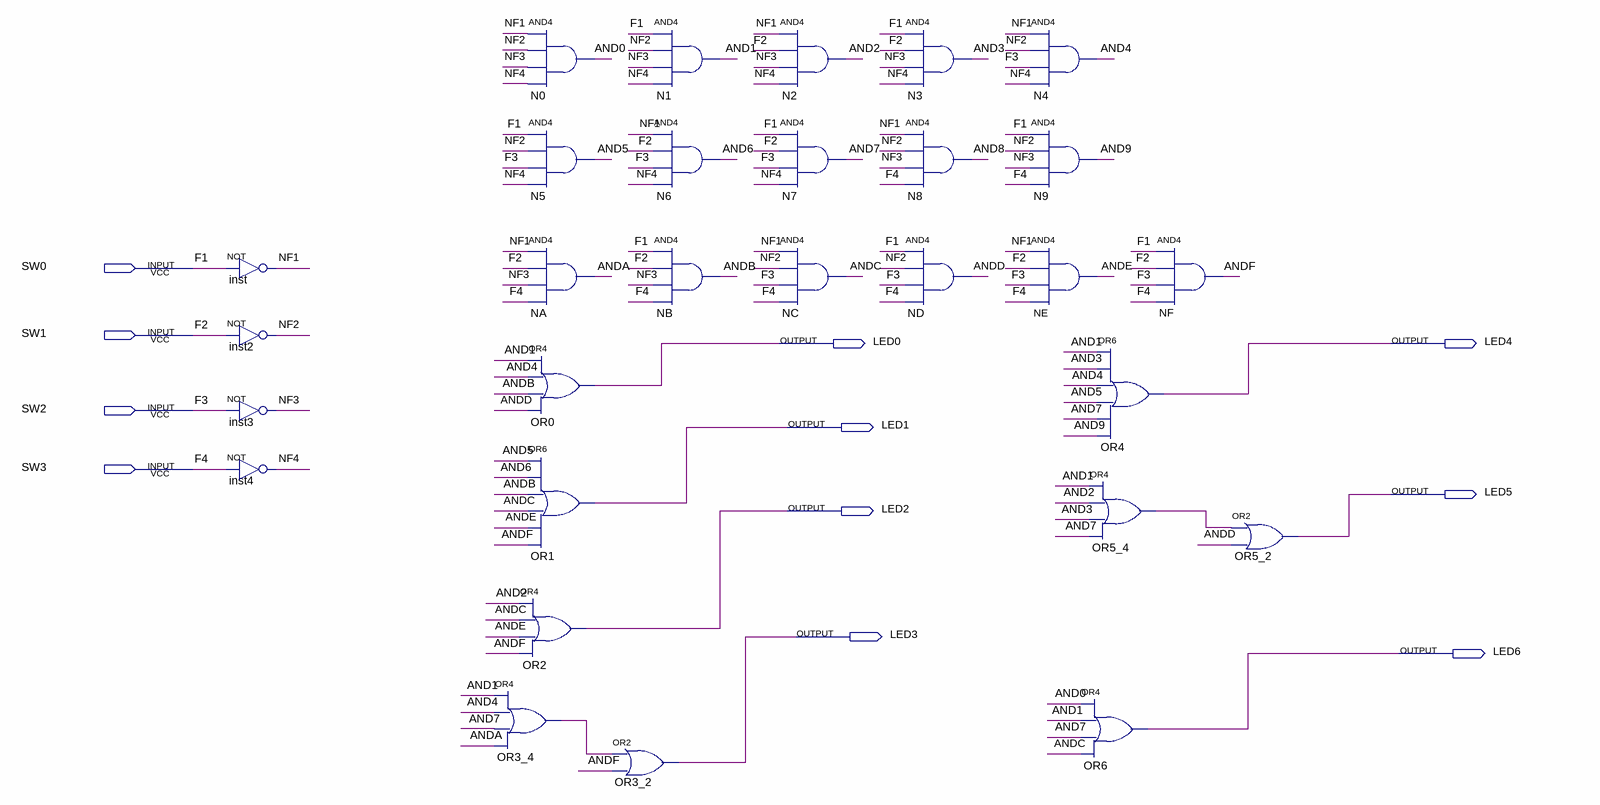
[diagram p0: schematic sheet]
// Quartus schematic Aula04.bdf as structural Verilog: 29 symbols, 11 pins
module Aula04 (
  input  SW0,
  input  SW1,
  input  SW2,
  input  SW3,
  output LED0,
  output LED4,
  output LED1,
  output LED5,
  output LED2,
  output LED3,
  output LED6
);

  wire AND0, AND1, AND2, AND3, AND4, AND5, AND6, AND7, AND8, AND9, ANDA, ANDB, ANDC, ANDD, ANDE, ANDF, NF1,
       NF2, NF3, NF4, OR3_4_out, OR5_4_out;

  not inst (NF1, SW0);
  not inst2 (NF2, SW1);
  not inst3 (NF3, SW2);
  not inst4 (NF4, SW3);
  or OR3_4 (OR3_4_out, AND1, AND4, AND7, ANDA);
  and N0 (AND0, NF1, NF2, NF3, NF4);
  and N5 (AND5, SW0, NF2, SW2, NF4);
  and NA (ANDA, NF1, SW1, NF3, SW3);
  or OR0 (LED0, AND1, AND4, ANDB, ANDD);
  or OR1 (LED1, AND5, AND6, ANDB, ANDC, ANDE, ANDF);
  or OR2 (LED2, AND2, ANDC, ANDE, ANDF);
  or OR3_2 (LED3, OR3_4_out, ANDF);
  and N1 (AND1, SW0, NF2, NF3, NF4);
  and N6 (AND6, NF1, SW1, SW2, NF4);
  and NB (ANDB, SW0, SW1, NF3, SW3);
  and N2 (AND2, NF1, SW1, NF3, NF4);
  and N7 (AND7, SW0, SW1, SW2, NF4);
  and NC (ANDC, NF1, NF2, SW2, SW3);
  and N3 (AND3, SW0, SW1, NF3, NF4);
  and N8 (AND8, NF1, NF2, NF3, SW3);
  and ND (ANDD, SW0, NF2, SW2, SW3);
  and N4 (AND4, NF1, NF2, SW2, NF4);
  and N9 (AND9, SW0, NF2, NF3, SW3);
  and NE (ANDE, NF1, SW1, SW2, SW3);
  or OR4 (LED4, AND1, AND3, AND4, AND5, AND7, AND9);
  or OR5_4 (OR5_4_out, AND1, AND2, AND3, AND7);
  or OR6 (LED6, AND0, AND1, AND7, ANDC);
  and NF (ANDF, SW0, SW1, SW2, SW3);
  or OR5_2 (LED5, OR5_4_out, ANDD);

  // Other names for the same wires on the sheet: F1 = SW0; F2 = SW1; F3 = SW2; F4 = SW3
endmodule
